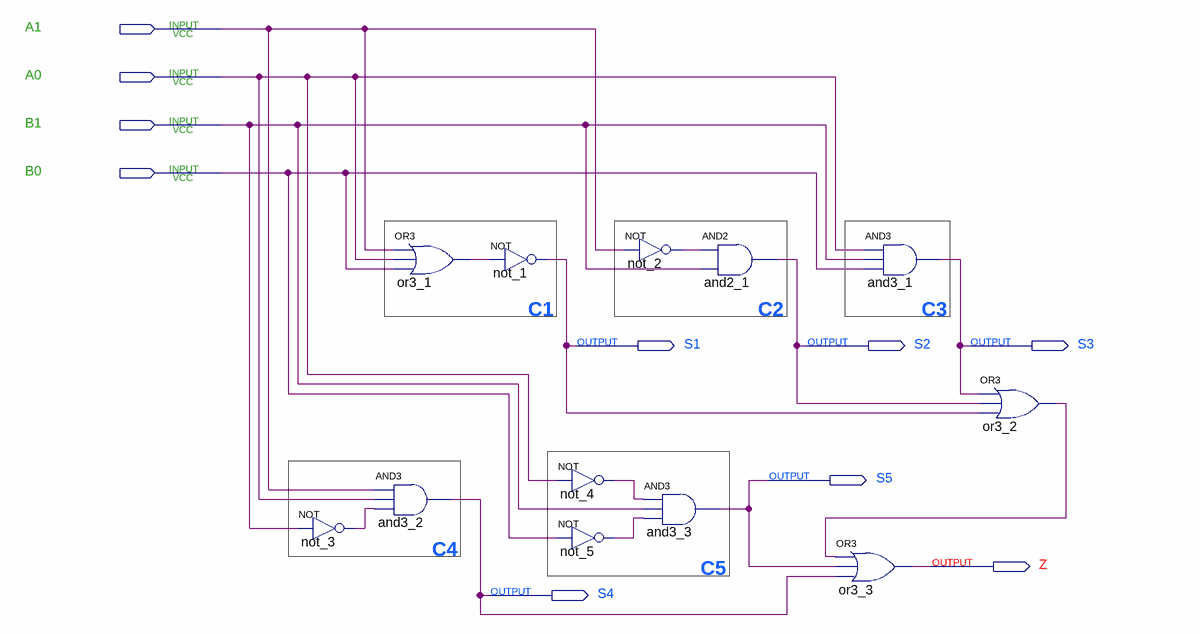
[diagram p0: schematic sheet]
// Quartus schematic exp02.bdf as structural Verilog: 12 symbols, 10 pins
module exp02 (
  input  A1,
  input  A0,
  input  B1,
  input  B0,
  output S1,
  output S2,
  output S3,
  output S5,
  output Z,
  output S4
);

  wire not_2_out, not_3_out, not_4_out, not_5_out, or3_1_out, or3_2_out;

  not not_3 (not_3_out, B1);
  or or3_1 (or3_1_out, A1, A0, B0);
  and and3_2 (S4, A1, A0, not_3_out);
  not not_1 (S1, or3_1_out);
  not not_4 (not_4_out, A0);
  not not_5 (not_5_out, B0);
  not not_2 (not_2_out, A1);
  and and3_3 (S5, not_4_out, B1, not_5_out);
  and and2_1 (S2, not_2_out, B1);
  and and3_1 (S3, A0, B1, B0);
  or or3_3 (Z, or3_2_out, S5, S4);
  or or3_2 (or3_2_out, S3, S2, S1);

  // Notes on the sheet:
  //   C1
  //   C2
  //   C3
  //   C4
  //   C5
endmodule
